# EAGLE schematic v1 (EAGLE 9.6.2)
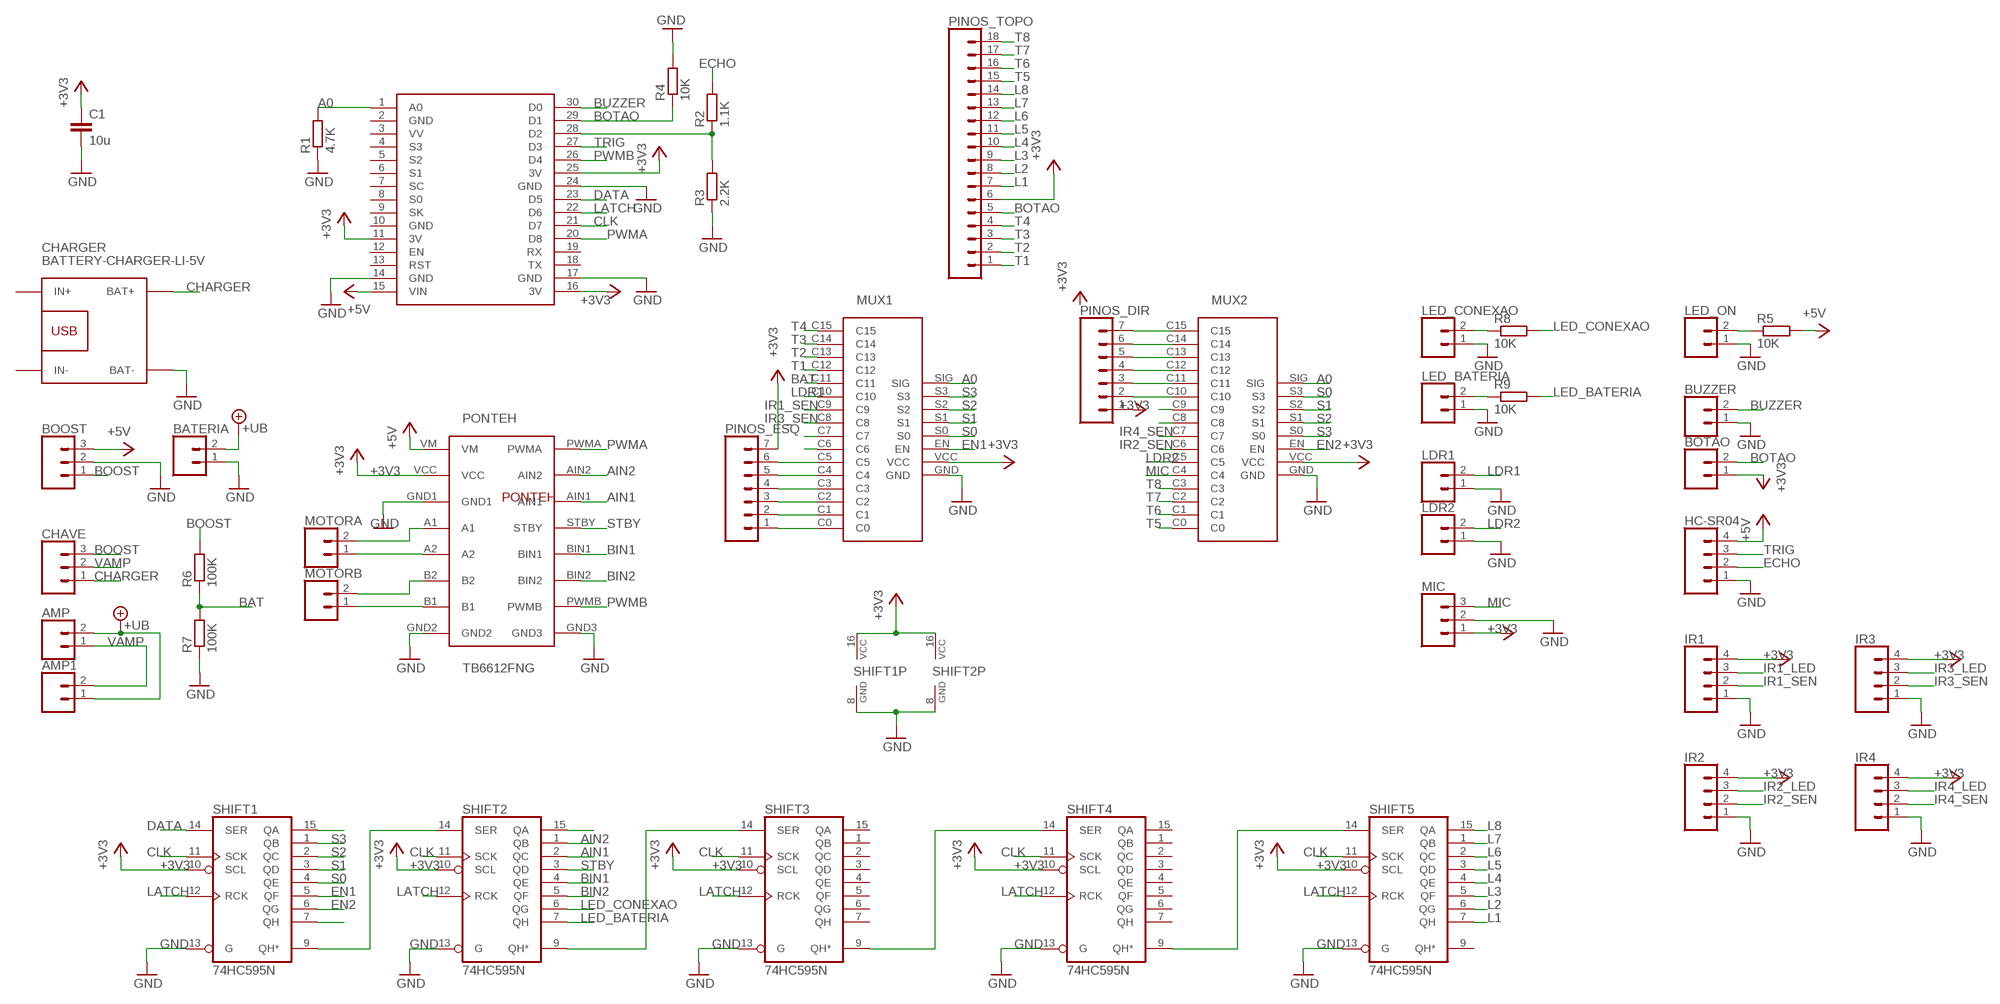
[diagram p0: schematic, sheet 1]

## Parts
AMP  CONN_02  [1X02]
AMP1  CONN_02  [1X02]
BATERIA  CONN_02  [1X02]
BOOST  CONN_03  [1X03]
BOTAO  CONN_02  [1X02]
BUZZER  CONN_02  [1X02]
C1  10u  C2,5-3  [C2.5-3]
CHARGER  BATTERY-CHARGER-LI-5V  [BATTERY-CHARGER-LI-5V]
CHAVE  CONN_03  [1X03]
HC-SR04  CONN_04  [1X04]
IR1  CONN_04  [1X04]
IR2  CONN_04  [1X04]
IR3  CONN_04  [1X04]
IR4  CONN_04  [1X04]
LDR1  CONN_02  [1X02]
LDR2  CONN_02  [1X02]
LED_BATERIA  CONN_02  [1X02]
LED_CONEXAO  CONN_02  [1X02]
LED_ON  CONN_02  [1X02]
MIC  CONN_03  [1X03]
MOTORA  CONN_02  [1X02]
MOTORB  CONN_02  [1X02]
MUX1  4067_MODULE  [4067_MODULE]
MUX2  4067_MODULE  [4067_MODULE]
NODEMCU  NODEMCU  [NODEMCU]
PINOS_DIR  CONN_07  [1X07]
PINOS_ESQ  CONN_07  [1X07]
PINOS_TOPO  CONN_18  [1X18]
PONTEH  TB6612FNG  [TB6612FNG]
R1  4.7K  R-EU_0204/7  [0204/7]
R2  1.1K  R-EU_0204/7  [0204/7]
R3  2.2K  R-EU_0204/7  [0204/7]
R4  10K  R-EU_0204/7  [0204/7]
R5  10K  R-EU_0204/7  [0204/7]
R6  100K  R-EU_0204/7  [0204/7]
R7  100K  R-EU_0204/7  [0204/7]
R8  10K  R-EU_0204/7  [0204/7]
R9  10K  R-EU_0204/7  [0204/7]
SHIFT1  74HC595N  [DIL16]
SHIFT2  74HC595N  [DIL16]
SHIFT3  74HC595N  [DIL16]
SHIFT4  74HC595N  [DIL16]
SHIFT5  74HC595N  [DIL16]

## Nets
+3V3: BOTAO.1 C1.1 IR1.4 IR2.4 IR3.4 IR4.4 MIC.1 MUX1.VCC MUX2.VCC NODEMCU.11(3V) NODEMCU.16(3V) NODEMCU.25(3V) PINOS_DIR.1 PINOS_ESQ.7 PINOS_TOPO.6 PONTEH.VCC SHIFT1.10(SCL) SHIFT1.16(VCC) SHIFT2.10(SCL) SHIFT2.16(VCC) SHIFT3.10(SCL) SHIFT4.10(SCL) SHIFT5.10(SCL)
+5V: BOOST.3 HC-SR04.4 NODEMCU.15(VIN) PONTEH.VM R5.2
+UB: AMP1.1 AMP.2 BATERIA.2
A0: MUX1.SIG MUX2.SIG NODEMCU.1(A0) R1.2
AIN1: PONTEH.AIN1 SHIFT2.2(QC)
AIN2: PONTEH.AIN2 SHIFT2.1(QB)
BAT: MUX1.C11 R6.1 R7.2
BIN1: PONTEH.BIN1 SHIFT2.4(QE)
BIN2: PONTEH.BIN2 SHIFT2.5(QF)
BOOST: BOOST.1 CHAVE.3 R6.2
BOTAO: BOTAO.2 NODEMCU.29(D1) PINOS_TOPO.5 R4.1
BUZZER: BUZZER.2 NODEMCU.30(D0)
CHARGER: CHARGER.BAT+ CHAVE.1
CLK: NODEMCU.21(D7) SHIFT1.11(SCK) SHIFT2.11(SCK) SHIFT3.11(SCK) SHIFT4.11(SCK) SHIFT5.11(SCK)
DATA: NODEMCU.23(D5) SHIFT1.14(SER)
ECHO: HC-SR04.2 R2.2
EN1: MUX1.EN SHIFT1.5(QF)
EN2: MUX2.EN SHIFT1.6(QG)
GND: BATERIA.1 BOOST.2 BUZZER.1 C1.2 CHARGER.BAT- HC-SR04.1 IR1.1 IR2.1 IR3.1 IR4.1 LDR1.1 LDR2.1 LED_BATERIA.1 LED_CONEXAO.1 LED_ON.1 MIC.2 MUX1.GND MUX2.GND NODEMCU.14(GND) NODEMCU.17(GND) NODEMCU.24(GND) PONTEH.GND1 PONTEH.GND2 PONTEH.GND3 R1.1 R3.1 R4.2 R7.1 SHIFT1.8(GND) SHIFT1.13(G) SHIFT2.8(GND) SHIFT2.13(G) SHIFT3.13(G) SHIFT4.13(G) SHIFT5.13(G)
IR1_LED: IR1.3
IR1_SEN: IR1.2 MUX1.C9
IR2_LED: IR2.3
IR2_SEN: IR2.2 MUX2.C6
IR3_LED: IR3.3
IR3_SEN: IR3.2 MUX1.C8
IR4_LED: IR4.3
IR4_SEN: IR4.2 MUX2.C7
L1: PINOS_TOPO.7 SHIFT5.7(QH)
L2: PINOS_TOPO.8 SHIFT5.6(QG)
L3: PINOS_TOPO.9 SHIFT5.5(QF)
L4: PINOS_TOPO.10 SHIFT5.4(QE)
L5: PINOS_TOPO.11 SHIFT5.3(QD)
L6: PINOS_TOPO.12 SHIFT5.2(QC)
L7: PINOS_TOPO.13 SHIFT5.1(QB)
L8: PINOS_TOPO.14 SHIFT5.15(QA)
LATCH: NODEMCU.22(D6) SHIFT1.12(RCK) SHIFT2.12(RCK) SHIFT3.12(RCK) SHIFT4.12(RCK) SHIFT5.12(RCK)
LDR1: LDR1.2 MUX1.C10
LDR2: LDR2.2 MUX2.C5
LED_BATERIA: R9.2 SHIFT2.7(QH)
LED_CONEXAO: R8.2 SHIFT2.6(QG)
MIC: MIC.3 MUX2.C4
N$1: MUX1.C6
N$2: MUX2.C9
N$3: MUX1.C7
N$5: SHIFT1.9(QH*) SHIFT2.14(SER)
N$6: MUX1.C5 PINOS_ESQ.6
N$7: MUX1.C4 PINOS_ESQ.5
N$8: MUX2.C15 PINOS_DIR.7
N$9: MUX2.C14 PINOS_DIR.6
N$10: MUX2.C13 PINOS_DIR.5
N$11: MUX2.C12 PINOS_DIR.4
N$12: MUX2.C11 PINOS_DIR.3
N$13: MUX2.C10 PINOS_DIR.2
N$15: MUX2.C8
N$18: MUX1.C3 PINOS_ESQ.4
N$19: MUX1.C2 PINOS_ESQ.3
N$20: MUX1.C1 PINOS_ESQ.2
N$21: MUX1.C0 PINOS_ESQ.1
N$22: LED_CONEXAO.2 R8.1
N$23: LED_BATERIA.2 R9.1
N$24: MOTORB.2 PONTEH.B2
N$25: MOTORB.1 PONTEH.B1
N$26: MOTORA.2 PONTEH.A1
N$27: MOTORA.1 PONTEH.A2
N$28: LED_ON.2 R5.1
N$29: SHIFT4.9(QH*) SHIFT5.14(SER)
N$30: SHIFT3.9(QH*) SHIFT4.14(SER)
N$31: SHIFT2.9(QH*) SHIFT3.14(SER)
N$38: SHIFT1.15(QA)
N$39: NODEMCU.28(D2) R2.1 R3.2
N$46: SHIFT1.7(QH)
N$47: SHIFT2.15(QA)
PWMA: NODEMCU.20(D8) PONTEH.PWMA
PWMB: NODEMCU.26(D4) PONTEH.PWMB
S0: MUX1.S0 MUX2.S3 SHIFT1.4(QE)
S1: MUX1.S1 MUX2.S2 SHIFT1.3(QD)
S2: MUX1.S2 MUX2.S1 SHIFT1.2(QC)
S3: MUX1.S3 MUX2.S0 SHIFT1.1(QB)
STBY: PONTEH.STBY SHIFT2.3(QD)
T1: MUX1.C12 PINOS_TOPO.1
T2: MUX1.C13 PINOS_TOPO.2
T3: MUX1.C14 PINOS_TOPO.3
T4: MUX1.C15 PINOS_TOPO.4
T5: MUX2.C0 PINOS_TOPO.15
T6: MUX2.C1 PINOS_TOPO.16
T7: MUX2.C2 PINOS_TOPO.17
T8: MUX2.C3 PINOS_TOPO.18
TRIG: HC-SR04.3 NODEMCU.27(D3)
VAMP: AMP1.2 AMP.1 CHAVE.2
Unconnected: CHARGER.IN+ CHARGER.IN- NODEMCU.3(VV) NODEMCU.4(S3) NODEMCU.5(S2) NODEMCU.6(S1) NODEMCU.7(SC) NODEMCU.8(S0) NODEMCU.9(SK) NODEMCU.12(EN) NODEMCU.13(RST) NODEMCU.18(TX) NODEMCU.19(RX) SHIFT3.1(QB) SHIFT3.2(QC) SHIFT3.3(QD) SHIFT3.4(QE) SHIFT3.5(QF) SHIFT3.6(QG) SHIFT3.7(QH) SHIFT3.15(QA) SHIFT4.1(QB) SHIFT4.2(QC) SHIFT4.3(QD) SHIFT4.4(QE) SHIFT4.5(QF) SHIFT4.6(QG) SHIFT4.7(QH) SHIFT4.15(QA) SHIFT5.9(QH*)

## Power pins joined to a net without a drawn wire
GND: NODEMCU.2(GND) NODEMCU.10(GND) SHIFT3.8(GND) SHIFT4.8(GND) SHIFT5.8(GND)
VCC: SHIFT3.16(VCC) SHIFT4.16(VCC) SHIFT5.16(VCC)

## Library data of the parts
AMP AMP1 BATERIA BOTAO BUZZER LDR1 LDR2 LED_BATERIA LED_CONEXAO LED_ON MOTORA MOTORB = SparkFun-Connectors:CONN_02: Multi connection point. Often used as Generic Header-pin footprint for 0.1 inch spaced/style header connections On any of the 0.1 inch spaced packages, you can populate with these: Break Away Headers - Straight <https://www.sparkfun.com/products/116> (PRT-00116) Break Away Male Headers - Right Angle <https://www.sparkfun.com/products/553> (PRT-00553) Female Headers <https://www.sparkfun.com/products/115> (PRT-00115) Break Away Headers - Machine Pin <https://www.sparkfun.com/products/117> (PRT-00117) Break Away Female Headers - Swiss Machine Pin <https://www.sparkfun.com/products/743> (PRT-00743) For SCREWTERMINALS and SPRING TERMINALS visit here: Screw Terimnals on SparkFun.com <https://www.sparkfun.com/search/results?term=Screw+Terminals> (5mm/3.5mm/2.54mm spacing) This device is also useful as a general connection point to wire up your design to another part of your project. Our various solder wires solder well into these plated through hole pads. Hook-Up Wire - Assortment (Stranded, 22 AWG) <https://www.sparkfun.com/products/11375> (PRT-11375) Hook-Up Wire - Assortment (Solid Core, 22 AWG) <https://www.sparkfun.com/products/11367> (PRT-11367) View the entire wire category on our website here <https://www.sparkfun.com/categories/141> Special notes: Molex polarized connector foot print use with: PRT-08233 with associated crimp pins and housings. 2.54_SCREWTERM for use with PRT-10571. 3.5mm Screw Terminal footprints for PRT-08084 5mm Screw Terminal footprints for use with PRT-08432
BOOST CHAVE MIC = SparkFun-Connectors:CONN_03: Multi connection point. Often used as Generic Header-pin footprint for 0.1 inch spaced/style header connections On any of the 0.1 inch spaced packages, you can populate with these: Break Away Headers - Straight <https://www.sparkfun.com/products/116> (PRT-00116) Break Away Male Headers - Right Angle <https://www.sparkfun.com/products/553> (PRT-00553) Female Headers <https://www.sparkfun.com/products/115> (PRT-00115) Break Away Headers - Machine Pin <https://www.sparkfun.com/products/117> (PRT-00117) Break Away Female Headers - Swiss Machine Pin <https://www.sparkfun.com/products/743> (PRT-00743) Stackable Header - 3 Pin (Female, 0.1") <https://www.sparkfun.com/products/13875> (PRT-13875) For SCREWTERMINALS and SPRING TERMINALS visit here: Screw Terimnals on SparkFun.com <https://www.sparkfun.com/search/results?term=Screw+Terminals> (5mm/3.5mm/2.54mm spacing) This device is also useful as a general connection point to wire up your design to another part of your project. Our various solder wires solder well into these plated through hole pads. Hook-Up Wire - Assortment (Stranded, 22 AWG) <https://www.sparkfun.com/products/11375> (PRT-11375) Hook-Up Wire - Assortment (Solid Core, 22 AWG) <https://www.sparkfun.com/products/11367> (PRT-11367) View the entire wire category on our website here <https://www.sparkfun.com/categories/141> Special notes: Molex polarized connector foot print use with SKU : PRT-08232 with associated crimp pins and housings.
C1 = capacitor-wima:C: CAPACITOR naming: grid - package width
CHARGER = diy-modules:BATTERY-CHARGER-LI-5V: Lithium Battery 5V Charger More details available here: http://www.buildcircuit.com/how-to-use-micro-usb-5v-1a-lithium-battery-charging-board-charger-module/ Click here to find device on ebay.com <http://www.ebay.com/sch/tp4056+charger+usb>
HC-SR04 IR1-IR4 = SparkFun-Connectors:CONN_04: Multi connection point. Often used as Generic Header-pin footprint for 0.1 inch spaced/style header connections On any of the 0.1 inch spaced packages, you can populate with these: Break Away Headers - Straight <https://www.sparkfun.com/products/116> (PRT-00116) Break Away Male Headers - Right Angle <https://www.sparkfun.com/products/553> (PRT-00553) Female Headers <https://www.sparkfun.com/products/115> (PRT-00115) Break Away Headers - Machine Pin <https://www.sparkfun.com/products/117> (PRT-00117) Break Away Female Headers - Swiss Machine Pin <https://www.sparkfun.com/products/743> (PRT-00743) For SCREWTERMINALS and SPRING TERMINALS visit here: Screw Terimnals on SparkFun.com <https://www.sparkfun.com/search/results?term=Screw+Terminals> (5mm/3.5mm/2.54mm spacing) This device is also useful as a general connection point to wire up your design to another part of your project. Our various solder wires solder well into these plated through hole pads. Hook-Up Wire - Assortment (Stranded, 22 AWG) <https://www.sparkfun.com/products/11375> (PRT-11375) Hook-Up Wire - Assortment (Solid Core, 22 AWG) <https://www.sparkfun.com/products/11367> (PRT-11367) View the entire wire category on our website here <https://www.sparkfun.com/categories/141> Special notes: Molex polarized connector foot print use with SKU : PRT-08231 with associated crimp pins and housings. 1MM SMD Version SKU: PRT-10208; PROD_ID: CONN-09696
MUX1 MUX2 = personal:4067_MODULE
NODEMCU = nodemcu:NODEMCU
PINOS_DIR PINOS_ESQ = SparkFun-Connectors:CONN_07: Multi connection point. Often used as Generic Header-pin footprint for 0.1 inch spaced/style header connections On any of the 0.1 inch spaced packages, you can populate with these: Break Away Headers - Straight <https://www.sparkfun.com/products/116> (PRT-00116) Break Away Male Headers - Right Angle <https://www.sparkfun.com/products/553> (PRT-00553) Female Headers <https://www.sparkfun.com/products/115> (PRT-00115) Break Away Headers - Machine Pin <https://www.sparkfun.com/products/117> (PRT-00117) Break Away Female Headers - Swiss Machine Pin <https://www.sparkfun.com/products/743> (PRT-00743) For SCREWTERMINALS and SPRING TERMINALS visit here: Screw Terimnals on SparkFun.com <https://www.sparkfun.com/search/results?term=Screw+Terminals> (5mm/3.5mm/2.54mm spacing) This device is also useful as a general connection point to wire up your design to another part of your project. Our various solder wires solder well into these plated through hole pads. Hook-Up Wire - Assortment (Stranded, 22 AWG) <https://www.sparkfun.com/products/11375> (PRT-11375) Hook-Up Wire - Assortment (Solid Core, 22 AWG) <https://www.sparkfun.com/products/11367> (PRT-11367) View the entire wire category on our website here <https://www.sparkfun.com/categories/141> Special notes: Molex polarized connector foot print use with SKU : PRT-08231 with associated crimp pins and housings. 1MM SMD Version SKU: PRT-10208 NOTES ON THE VARIANTS LOCK and LOCK_LONGPADS... This footprint was designed to help hold the alignment of a through-hole component (i.e. 6-pin header) while soldering it into place. You may notice that each hole has been shifted either up or down by 0.005 of an inch from it's more standard position (which is a perfectly straight line). This slight alteration caused the pins (the squares in the middle) to touch the edges of the holes. Because they are alternating, it causes a "brace" to hold the component in place. 0.005 has proven to be the perfect amount of "off-center" position when using our standard breakaway headers. Although looks a little odd when you look at the bare footprint, once you have a header in there, the alteration is very hard to notice. Also,if you push a header all the way into place, it is covered up entirely on the bottom side.
PINOS_TOPO = SparkFun-Connectors:CONN_18: Multi connection point. Often used as Generic Header-pin footprint for 0.1 inch spaced/style header connections On any of the 0.1 inch spaced packages, you can populate with these: Break Away Headers - Straight <https://www.sparkfun.com/products/116> (PRT-00116) Break Away Male Headers - Right Angle <https://www.sparkfun.com/products/553> (PRT-00553) Female Headers <https://www.sparkfun.com/products/115> (PRT-00115) Break Away Headers - Machine Pin <https://www.sparkfun.com/products/117> (PRT-00117) Break Away Female Headers - Swiss Machine Pin <https://www.sparkfun.com/products/743> (PRT-00743) For SCREWTERMINALS and SPRING TERMINALS visit here: Screw Terimnals on SparkFun.com <https://www.sparkfun.com/search/results?term=Screw+Terminals> (5mm/3.5mm/2.54mm spacing) This device is also useful as a general connection point to wire up your design to another part of your project. Our various solder wires solder well into these plated through hole pads. Hook-Up Wire - Assortment (Stranded, 22 AWG) <https://www.sparkfun.com/products/11375> (PRT-11375) Hook-Up Wire - Assortment (Solid Core, 22 AWG) <https://www.sparkfun.com/products/11367> (PRT-11367) View the entire wire category on our website here <https://www.sparkfun.com/categories/141> Special notes: Molex polarized connector foot print use with SKU : PRT-08231 with associated crimp pins and housings. 1MM SMD Version SKU: PRT-10208 NOTES ON THE VARIANTS LOCK and LOCK_LONGPADS... This footprint was designed to help hold the alignment of a through-hole component (i.e. 6-pin header) while soldering it into place. You may notice that each hole has been shifted either up or down by 0.005 of an inch from it's more standard position (which is a perfectly straight line). This slight alteration caused the pins (the squares in the middle) to touch the edges of the holes. Because they are alternating, it causes a "brace" to hold the component in place. 0.005 has proven to be the perfect amount of "off-center" position when using our standard breakaway headers. Although looks a little odd when you look at the bare footprint, once you have a header in there, the alteration is very hard to notice. Also,if you push a header all the way into place, it is covered up entirely on the bottom side.
PONTEH = TB6612FNG:TB6612FNG
R1-R9 = rcl:R-EU_: RESISTOR, European symbol; SPICEPREFIX: R
SHIFT1-SHIFT5 = 74xx-eu:74*595: 8-bit SHIFT REGISTER, output latch